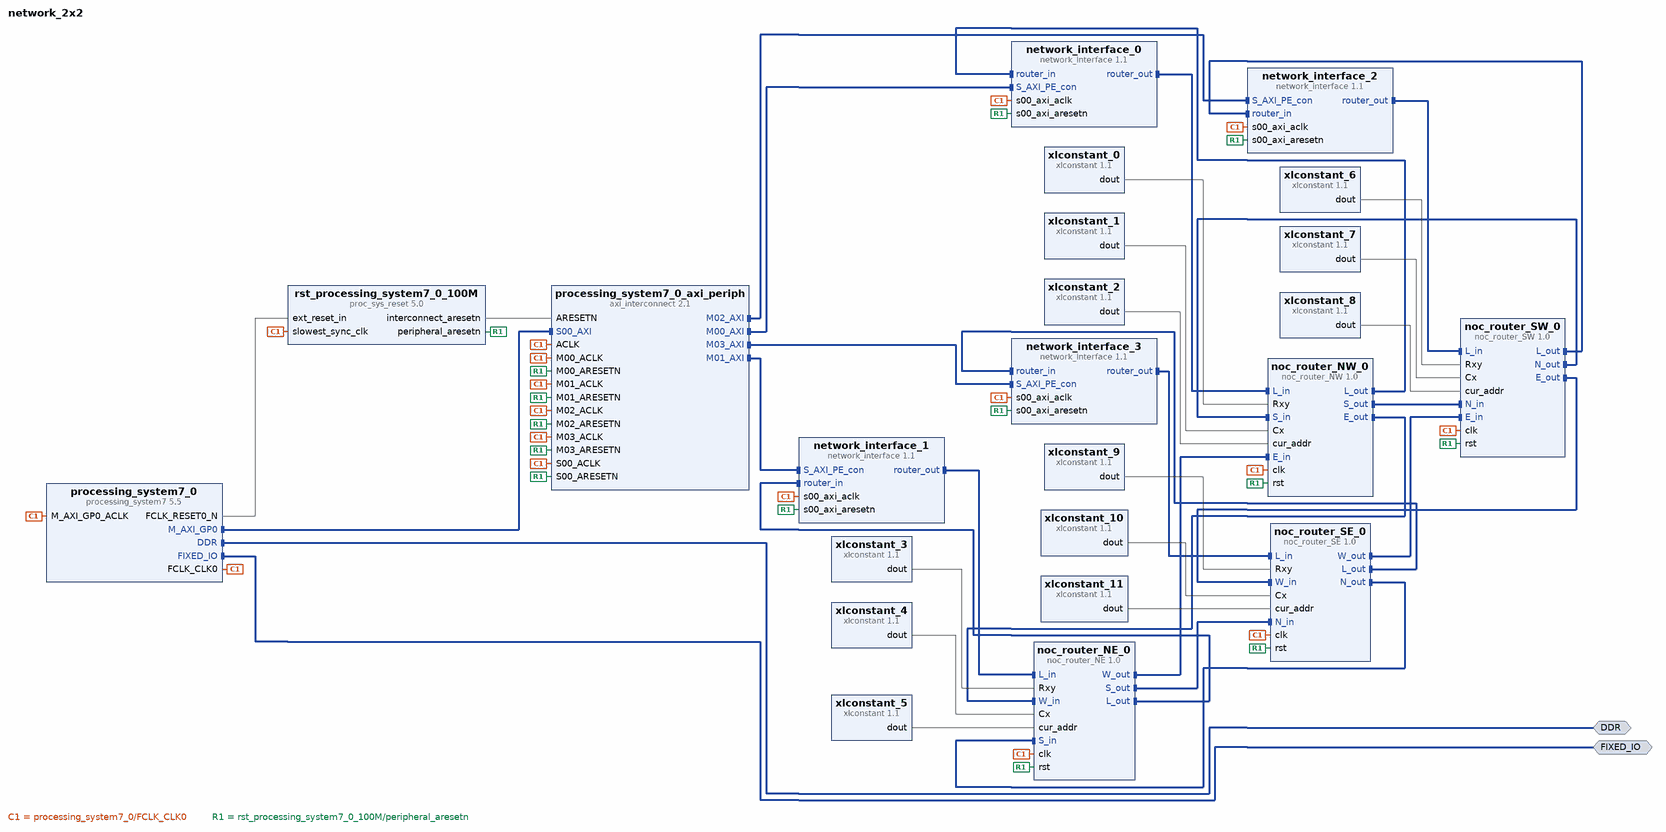
[diagram p0: block diagram of the top level]
# Vivado block design network_2x2, Vivado 2015.1
create_bd_design network_2x2

create_bd_intf_port -mode Master -vlnv xilinx.com:interface:ddrx_rtl:1.0 DDR
create_bd_intf_port -mode Master -vlnv xilinx.com:display_processing_system7:fixedio_rtl:1.0 FIXED_IO

create_bd_cell -type ip -vlnv ttu.ee:user:noc_router_NE:1.0 noc_router_NE_0
create_bd_cell -type ip -vlnv ttu.ee:user:noc_router_NW:1.0 noc_router_NW_0
create_bd_cell -type ip -vlnv ttu.ee:user:noc_router_SE:1.0 noc_router_SE_0
create_bd_cell -type ip -vlnv ttu.ee:user:noc_router_SW:1.0 noc_router_SW_0
create_bd_cell -type ip -vlnv xilinx.com:ip:xlconstant:1.1 xlconstant_0
set_property -dict {CONFIG.CONST_WIDTH 8 CONFIG.CONST_VAL 60} [get_bd_cells xlconstant_0]
create_bd_cell -type ip -vlnv xilinx.com:ip:xlconstant:1.1 xlconstant_1
set_property -dict {CONFIG.CONST_WIDTH 4 CONFIG.CONST_VAL 10} [get_bd_cells xlconstant_1]
create_bd_cell -type ip -vlnv xilinx.com:ip:xlconstant:1.1 xlconstant_2
set_property -dict {CONFIG.CONST_WIDTH 2 CONFIG.CONST_VAL 0} [get_bd_cells xlconstant_2]
create_bd_cell -type ip -vlnv xilinx.com:ip:xlconstant:1.1 xlconstant_3
set_property -dict {CONFIG.CONST_WIDTH 8 CONFIG.CONST_VAL 60} [get_bd_cells xlconstant_3]
create_bd_cell -type ip -vlnv xilinx.com:ip:xlconstant:1.1 xlconstant_4
set_property -dict {CONFIG.CONST_WIDTH 4 CONFIG.CONST_VAL 12} [get_bd_cells xlconstant_4]
create_bd_cell -type ip -vlnv xilinx.com:ip:xlconstant:1.1 xlconstant_5
set_property -dict {CONFIG.CONST_WIDTH 2 CONFIG.CONST_VAL 1} [get_bd_cells xlconstant_5]
create_bd_cell -type ip -vlnv xilinx.com:ip:xlconstant:1.1 xlconstant_6
set_property -dict {CONFIG.CONST_WIDTH 8 CONFIG.CONST_VAL 60} [get_bd_cells xlconstant_6]
create_bd_cell -type ip -vlnv xilinx.com:ip:xlconstant:1.1 xlconstant_7
set_property -dict {CONFIG.CONST_WIDTH 4 CONFIG.CONST_VAL 3} [get_bd_cells xlconstant_7]
create_bd_cell -type ip -vlnv xilinx.com:ip:xlconstant:1.1 xlconstant_8
set_property -dict {CONFIG.CONST_WIDTH 2 CONFIG.CONST_VAL 2} [get_bd_cells xlconstant_8]
create_bd_cell -type ip -vlnv xilinx.com:ip:xlconstant:1.1 xlconstant_9
set_property -dict {CONFIG.CONST_WIDTH 8 CONFIG.CONST_VAL 60} [get_bd_cells xlconstant_9]
create_bd_cell -type ip -vlnv xilinx.com:ip:xlconstant:1.1 xlconstant_10
set_property -dict {CONFIG.CONST_WIDTH 4 CONFIG.CONST_VAL 5} [get_bd_cells xlconstant_10]
create_bd_cell -type ip -vlnv xilinx.com:ip:xlconstant:1.1 xlconstant_11
set_property -dict {CONFIG.CONST_WIDTH 2 CONFIG.CONST_VAL 3} [get_bd_cells xlconstant_11]
create_bd_cell -type ip -vlnv xilinx.com:ip:processing_system7:5.5 processing_system7_0
set_property -dict {CONFIG.preset ZedBoard} [get_bd_cells processing_system7_0]
create_bd_cell -type ip -vlnv ttu.ee:user:network_interface:1.1 network_interface_0
create_bd_cell -type ip -vlnv xilinx.com:ip:axi_interconnect:2.1 processing_system7_0_axi_periph
set_property -dict {CONFIG.NUM_MI 4} [get_bd_cells processing_system7_0_axi_periph]
create_bd_cell -type ip -vlnv xilinx.com:ip:proc_sys_reset:5.0 rst_processing_system7_0_100M
create_bd_cell -type ip -vlnv ttu.ee:user:network_interface:1.1 network_interface_1
create_bd_cell -type ip -vlnv ttu.ee:user:network_interface:1.1 network_interface_2
create_bd_cell -type ip -vlnv ttu.ee:user:network_interface:1.1 network_interface_3

# ---- connections ----

connect_bd_intf_net [get_bd_intf_pins noc_router_NW_0/E_out] [get_bd_intf_pins noc_router_NE_0/W_in]
connect_bd_intf_net [get_bd_intf_pins noc_router_NW_0/S_out] [get_bd_intf_pins noc_router_SW_0/N_in]
connect_bd_intf_net [get_bd_intf_pins noc_router_NE_0/W_out] [get_bd_intf_pins noc_router_NW_0/E_in]
connect_bd_intf_net [get_bd_intf_pins noc_router_NE_0/S_out] [get_bd_intf_pins noc_router_SE_0/N_in]
connect_bd_intf_net [get_bd_intf_pins noc_router_SE_0/N_out] [get_bd_intf_pins noc_router_NE_0/S_in]
connect_bd_intf_net [get_bd_intf_pins noc_router_SE_0/W_out] [get_bd_intf_pins noc_router_SW_0/E_in]
connect_bd_intf_net [get_bd_intf_pins noc_router_SW_0/N_out] [get_bd_intf_pins noc_router_NW_0/S_in]
connect_bd_intf_net [get_bd_intf_pins noc_router_SW_0/E_out] [get_bd_intf_pins noc_router_SE_0/W_in]
connect_bd_intf_net [get_bd_intf_pins processing_system7_0/M_AXI_GP0] [get_bd_intf_pins processing_system7_0_axi_periph/S00_AXI]
connect_bd_intf_net [get_bd_intf_pins processing_system7_0_axi_periph/M00_AXI] [get_bd_intf_pins network_interface_0/S_AXI_PE_con]
connect_bd_intf_net [get_bd_intf_pins processing_system7_0_axi_periph/M01_AXI] [get_bd_intf_pins network_interface_1/S_AXI_PE_con]
connect_bd_intf_net [get_bd_intf_pins processing_system7_0_axi_periph/M02_AXI] [get_bd_intf_pins network_interface_2/S_AXI_PE_con]
connect_bd_intf_net [get_bd_intf_pins processing_system7_0_axi_periph/M03_AXI] [get_bd_intf_pins network_interface_3/S_AXI_PE_con]
connect_bd_intf_net [get_bd_intf_pins network_interface_3/router_in] [get_bd_intf_pins noc_router_SE_0/L_out]
connect_bd_intf_net [get_bd_intf_pins network_interface_3/router_out] [get_bd_intf_pins noc_router_SE_0/L_in]
connect_bd_intf_net [get_bd_intf_pins network_interface_2/router_in] [get_bd_intf_pins noc_router_SW_0/L_out]
connect_bd_intf_net [get_bd_intf_pins network_interface_2/router_out] [get_bd_intf_pins noc_router_SW_0/L_in]
connect_bd_intf_net [get_bd_intf_pins network_interface_0/router_in] [get_bd_intf_pins noc_router_NW_0/L_out]
connect_bd_intf_net [get_bd_intf_pins network_interface_0/router_out] [get_bd_intf_pins noc_router_NW_0/L_in]
connect_bd_intf_net [get_bd_intf_pins network_interface_1/router_in] [get_bd_intf_pins noc_router_NE_0/L_out]
connect_bd_intf_net [get_bd_intf_pins network_interface_1/router_out] [get_bd_intf_pins noc_router_NE_0/L_in]
connect_bd_intf_net [get_bd_intf_ports DDR] [get_bd_intf_pins processing_system7_0/DDR]
connect_bd_intf_net [get_bd_intf_ports FIXED_IO] [get_bd_intf_pins processing_system7_0/FIXED_IO]
connect_bd_net [get_bd_pins xlconstant_0/dout] [get_bd_pins noc_router_NW_0/Rxy]
connect_bd_net [get_bd_pins xlconstant_1/dout] [get_bd_pins noc_router_NW_0/Cx]
connect_bd_net [get_bd_pins xlconstant_2/dout] [get_bd_pins noc_router_NW_0/cur_addr]
connect_bd_net [get_bd_pins xlconstant_3/dout] [get_bd_pins noc_router_NE_0/Rxy]
connect_bd_net [get_bd_pins xlconstant_4/dout] [get_bd_pins noc_router_NE_0/Cx]
connect_bd_net [get_bd_pins xlconstant_5/dout] [get_bd_pins noc_router_NE_0/cur_addr]
connect_bd_net [get_bd_pins xlconstant_6/dout] [get_bd_pins noc_router_SW_0/Rxy]
connect_bd_net [get_bd_pins xlconstant_7/dout] [get_bd_pins noc_router_SW_0/Cx]
connect_bd_net [get_bd_pins xlconstant_8/dout] [get_bd_pins noc_router_SW_0/cur_addr]
connect_bd_net [get_bd_pins xlconstant_9/dout] [get_bd_pins noc_router_SE_0/Rxy]
connect_bd_net [get_bd_pins xlconstant_10/dout] [get_bd_pins noc_router_SE_0/Cx]
connect_bd_net [get_bd_pins xlconstant_11/dout] [get_bd_pins noc_router_SE_0/cur_addr]
connect_bd_net [get_bd_pins processing_system7_0/FCLK_CLK0] \
  [get_bd_pins processing_system7_0/M_AXI_GP0_ACLK] [get_bd_pins rst_processing_system7_0_100M/slowest_sync_clk] \
  [get_bd_pins network_interface_0/s00_axi_aclk] [get_bd_pins network_interface_1/s00_axi_aclk] \
  [get_bd_pins network_interface_2/s00_axi_aclk] [get_bd_pins network_interface_3/s00_axi_aclk] \
  [get_bd_pins noc_router_NW_0/clk] [get_bd_pins noc_router_NE_0/clk] [get_bd_pins noc_router_SE_0/clk] \
  [get_bd_pins noc_router_SW_0/clk] [get_bd_pins processing_system7_0_axi_periph/S00_ACLK] \
  [get_bd_pins processing_system7_0_axi_periph/ACLK] [get_bd_pins processing_system7_0_axi_periph/M00_ACLK] \
  [get_bd_pins processing_system7_0_axi_periph/M01_ACLK] [get_bd_pins processing_system7_0_axi_periph/M02_ACLK] \
  [get_bd_pins processing_system7_0_axi_periph/M03_ACLK]
connect_bd_net [get_bd_pins processing_system7_0/FCLK_RESET0_N] [get_bd_pins rst_processing_system7_0_100M/ext_reset_in]
connect_bd_net [get_bd_pins rst_processing_system7_0_100M/peripheral_aresetn] \
  [get_bd_pins network_interface_0/s00_axi_aresetn] [get_bd_pins network_interface_1/s00_axi_aresetn] \
  [get_bd_pins network_interface_2/s00_axi_aresetn] [get_bd_pins network_interface_3/s00_axi_aresetn] \
  [get_bd_pins noc_router_NW_0/rst] [get_bd_pins noc_router_NE_0/rst] [get_bd_pins noc_router_SE_0/rst] \
  [get_bd_pins noc_router_SW_0/rst] [get_bd_pins processing_system7_0_axi_periph/S00_ARESETN] \
  [get_bd_pins processing_system7_0_axi_periph/M00_ARESETN] [get_bd_pins processing_system7_0_axi_periph/M01_ARESETN] \
  [get_bd_pins processing_system7_0_axi_periph/M02_ARESETN] [get_bd_pins processing_system7_0_axi_periph/M03_ARESETN]
connect_bd_net [get_bd_pins rst_processing_system7_0_100M/interconnect_aresetn] [get_bd_pins processing_system7_0_axi_periph/ARESETN]

# ---- address map ----
assign_bd_address -offset 0x43C00000 -range 64K -target_address_space [get_bd_addr_spaces processing_system7_0/Data] [get_bd_addr_segs network_interface_0/S00_AXI/S00_AXI_reg]
assign_bd_address -offset 0x43C10000 -range 64K -target_address_space [get_bd_addr_spaces processing_system7_0/Data] [get_bd_addr_segs network_interface_1/S00_AXI/S00_AXI_reg]
assign_bd_address -offset 0x43C20000 -range 64K -target_address_space [get_bd_addr_spaces processing_system7_0/Data] [get_bd_addr_segs network_interface_2/S00_AXI/S00_AXI_reg]
assign_bd_address -offset 0x43C30000 -range 64K -target_address_space [get_bd_addr_spaces processing_system7_0/Data] [get_bd_addr_segs network_interface_3/S00_AXI/S00_AXI_reg]

validate_bd_design
save_bd_design
